# Altium schematic sheet TubesMagangURO.SchDoc
size A; SheetNumber: 1; SheetTotal: 1
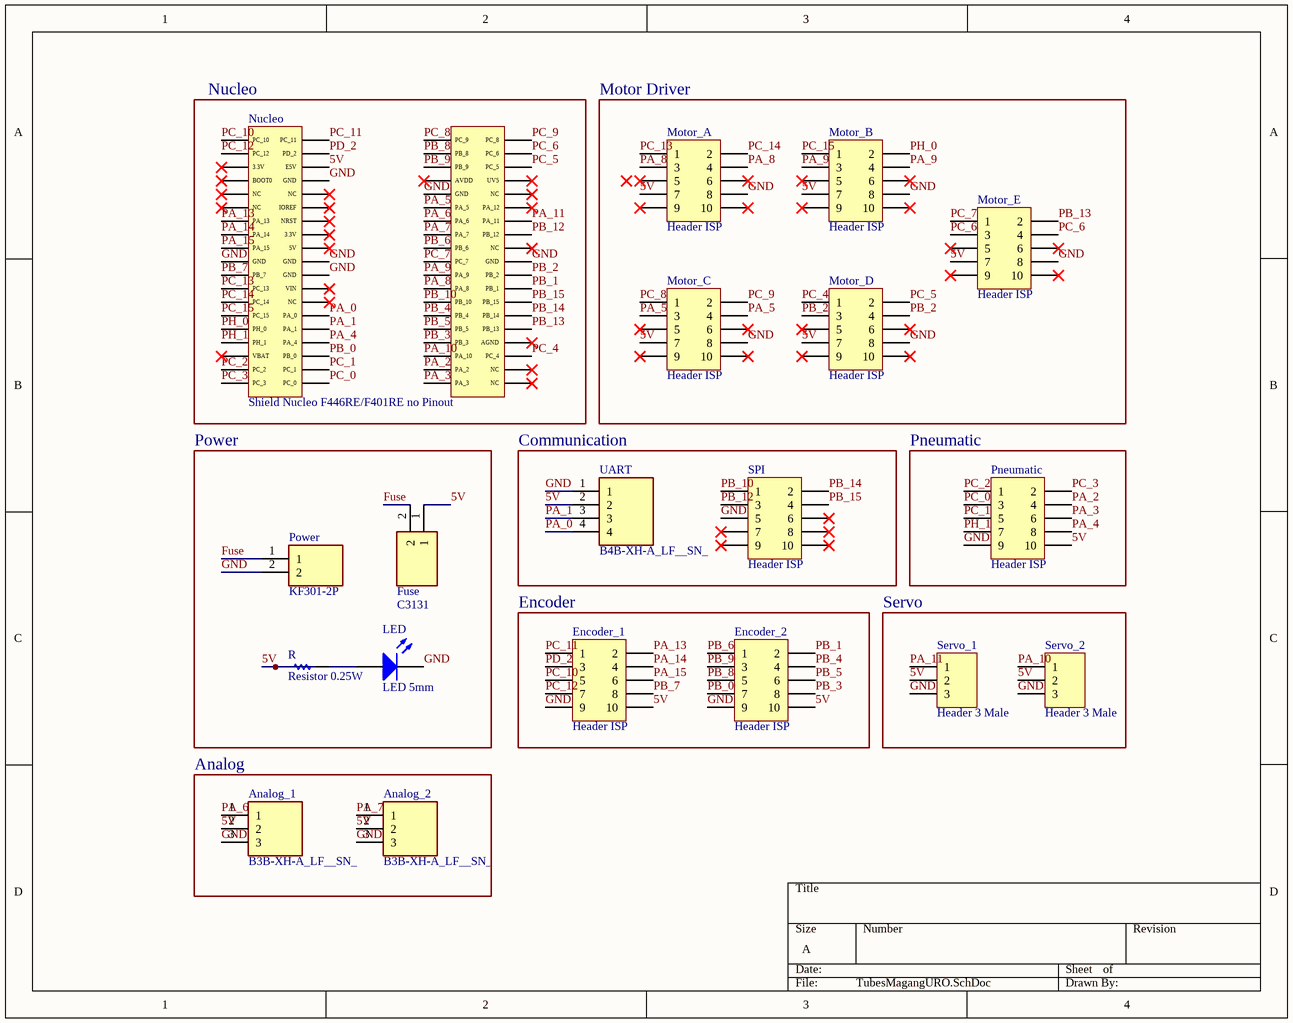
[diagram p0: TubesMagangURO.SchDoc]

## Parts
Analog_1  B3B-XH-A_LF__SN_  [B3BXHALFSN]
Analog_2  B3B-XH-A_LF__SN_  [B3BXHALFSN]
Encoder_1  Header ISP  [Header ISP]
Encoder_2  Header ISP  [Header ISP]
Fuse  C3131  [C3131]
LED  LED 5mm  [LED 5mm]
Motor_A  Header ISP  [Header ISP]
Motor_B  Header ISP  [Header ISP]
Motor_C  Header ISP  [Header ISP]
Motor_D  Header ISP  [Header ISP]
Motor_E  Header ISP  [Header ISP]
Nucleo  Shield Nucleo F446RE/F401RE no Pinout  [Shield Nucleo-F446RE/F401RE-tanpaPinOut]
Pneumatic  Header ISP  [Header ISP]
Power  KF301-2P  [KF3012P]
R  Resistor 0.25W  [Resistor 0.25W]
Servo_1  Header 3 Male  [Header 3 Male]
Servo_2  Header 3 Male  [Header 3 Male]
SPI  Header ISP  [Header ISP]
UART  B4B-XH-A_LF__SN_  [B4BXHALFSN]

## Blocks framed on the sheet
Nucleo: Nucleo
Motor Driver: Motor_A Motor_B Motor_C Motor_D Motor_E
Power: Fuse LED Power R
Communication: SPI UART
Pneumatic: Pneumatic
Encoder: Encoder_1 Encoder_2
Servo: Servo_1 Servo_2
Analog: Analog_1 Analog_2

## Nets
5V: Analog_1.2 Analog_2.2 Encoder_1.10 Encoder_2.10 Fuse.1 Motor_A.7 Motor_B.7 Motor_C.7 Motor_D.7 Motor_E.7 Nucleo.E5V Pneumatic.10 R.1 Servo_1.2 Servo_2.2 UART.2
Fuse: Fuse.2 Power.1
GND: Analog_1.3 Analog_2.3 Encoder_1.9 Encoder_2.9 LED.2(K) Motor_A.8 Motor_B.8 Motor_C.8 Motor_D.8 Motor_E.8 Nucleo.GND Nucleo.GND1(GND) Nucleo.GND2(GND) Nucleo.GND3(GND) Nucleo.GND4(GND) Nucleo.GND5(GND) Pneumatic.9 Power.2 Servo_1.3 Servo_2.3 SPI.5 UART.1
PA_0: Nucleo.PA_0 UART.4
PA_1: Nucleo.PA_1 UART.3
PA_2: Nucleo.PA_2 Pneumatic.4
PA_3: Nucleo.PA_3 Pneumatic.6
PA_4: Nucleo.PA_4 Pneumatic.8
PA_5: Motor_C.3 Motor_C.4 Nucleo.PA_5
PA_6: Analog_1.1 Nucleo.PA_6
PA_7: Analog_2.1 Nucleo.PA_7
PA_8: Motor_A.3 Motor_A.4 Nucleo.PA_8
PA_9: Motor_B.3 Motor_B.4 Nucleo.PA_9
PA_10: Nucleo.PA_10 Servo_2.1
PA_11: Nucleo.PA_11 Servo_1.1
PA_13: Encoder_1.2 Nucleo.PA_13
PA_14: Encoder_1.4 Nucleo.PA_14
PA_15: Encoder_1.6 Nucleo.PA_15
PB_0: Encoder_2.7 Nucleo.PB_0
PB_1: Encoder_2.2 Nucleo.PB_1
PB_2: Motor_D.3 Motor_D.4 Nucleo.PB_2
PB_3: Encoder_2.8 Nucleo.PB_3
PB_4: Encoder_2.4 Nucleo.PB_4
PB_5: Encoder_2.6 Nucleo.PB_5
PB_6: Encoder_2.1 Nucleo.PB_6
PB_7: Encoder_1.8 Nucleo.PB_7
PB_8: Encoder_2.5 Nucleo.PB_8
PB_9: Encoder_2.3 Nucleo.PB_9
PB_10: Nucleo.PB_10 SPI.1
PB_12: Nucleo.PB_12 SPI.3
PB_13: Motor_E.2 Nucleo.PB_13
PB_14: Nucleo.PB_14 SPI.2
PB_15: Nucleo.PB_15 SPI.4
PC_0: Nucleo.PC_0 Pneumatic.3
PC_1: Nucleo.PC_1 Pneumatic.5
PC_2: Nucleo.PC_2 Pneumatic.1
PC_3: Nucleo.PC_3 Pneumatic.2
PC_4: Motor_D.1 Nucleo.PC_4
PC_5: Motor_D.2 Nucleo.PC_5
PC_6: Motor_E.3 Motor_E.4 Nucleo.PC_6
PC_7: Motor_E.1 Nucleo.PC_7
PC_8: Motor_C.1 Nucleo.PC_9
PC_9: Motor_C.2 Nucleo.PC_8
PC_10: Encoder_1.5 Nucleo.PC_10
PC_11: Encoder_1.1 Nucleo.PC_11
PC_12: Encoder_1.7 Nucleo.PC_12
PC_13: Motor_A.1 Nucleo.PC_13
PC_14: Motor_A.2 Nucleo.PC_14
PC_15: Motor_B.1 Nucleo.PC_15
PD_2: Encoder_1.3 Nucleo.PD_2
PH_0: Motor_B.2 Nucleo.PH_0
PH_1: Nucleo.PH_1 Pneumatic.7
NetLED_1: LED.1(A) R.2

Not connected (* = marked no-connect by the designer): Motor_A 5* 6* 9* 10*; Motor_B 5* 6* 9* 10*; Motor_C 5* 6* 9* 10*; Motor_D 5* 6* 9* 10*; Motor_E 5* 6* 9* 10*; Nucleo 3.3V* 3V3(3.3V)* 5V* AGND* AVDD* BOOT0* IOREF* NC1(NC)* NC2(NC)* NC3(NC)* NC4(NC)* NC5(NC)* NC6(NC)* NC7(NC)* NC8(NC)* NRST* PA_12* UV5* VBAT* VIN*; SPI 6* 7* 8* 9* 10*

## Library data of the parts
Analog_1 Analog_2 = B3B-XH-A_LF__SN_: Connector; Manufacturer_Name: JST (JAPAN SOLDERLESS TERMINALS); Manufacturer_Part_Number: B3B-XH-A(LF)(SN); Datasheet Link: https://datasheet.lcsc.com/szlcsc/1812131720_JST-Sales-America-B3B-XH-A-LF-SN_C144394.pdf; Height: 7mm; Arrow Part Number: B3B-XH-A(LF)(SN); Arrow Price/Stock: https://www.arrow.com/en/products/b3b-xh-a-lf-sn/jst-manufacturing?region=europe
Fuse = C3131: Undefined or Miscellaneous; Manufacturer_Name: Xucheng Elec; Datasheet Link: https://datasheet.lcsc.com/szlcsc/XC-Elec-Shenzhen-5x20-BLX-Fuse-holder_C3131.pdf; Height: 10.5mm; Manufacturer_Part_Number: C3131
Nucleo = Shield Nucleo-F446RE/F401RE-tanpa Pinout: Tanpa Pinout
Power = KF301-2P: Connector; Manufacturer_Name: Handson Technology; Datasheet Link: http://www.handsontec.com/dataspecs/terminal%20block-5mm.pdf; Height: 10mm; Manufacturer_Part_Number: KF301-2P
UART = B4B-XH-A_LF__SN_: Connector; Manufacturer_Name: JST (JAPAN SOLDERLESS TERMINALS); Manufacturer_Part_Number: B4B-XH-A(LF)(SN); Datasheet Link: https://datasheet.lcsc.com/szlcsc/JST-Sales-America-B4B-XH-A-LF-SN_C144395.pdf; Height: 7mm; Arrow Part Number: B4B-XH-A(LF)(SN); Arrow Price/Stock: https://www.arrow.com/en/products/b4b-xh-a-lf-sn/jst-manufacturing